# EAGLE design SkyKontrol-Display (EAGLE 9.5.1)
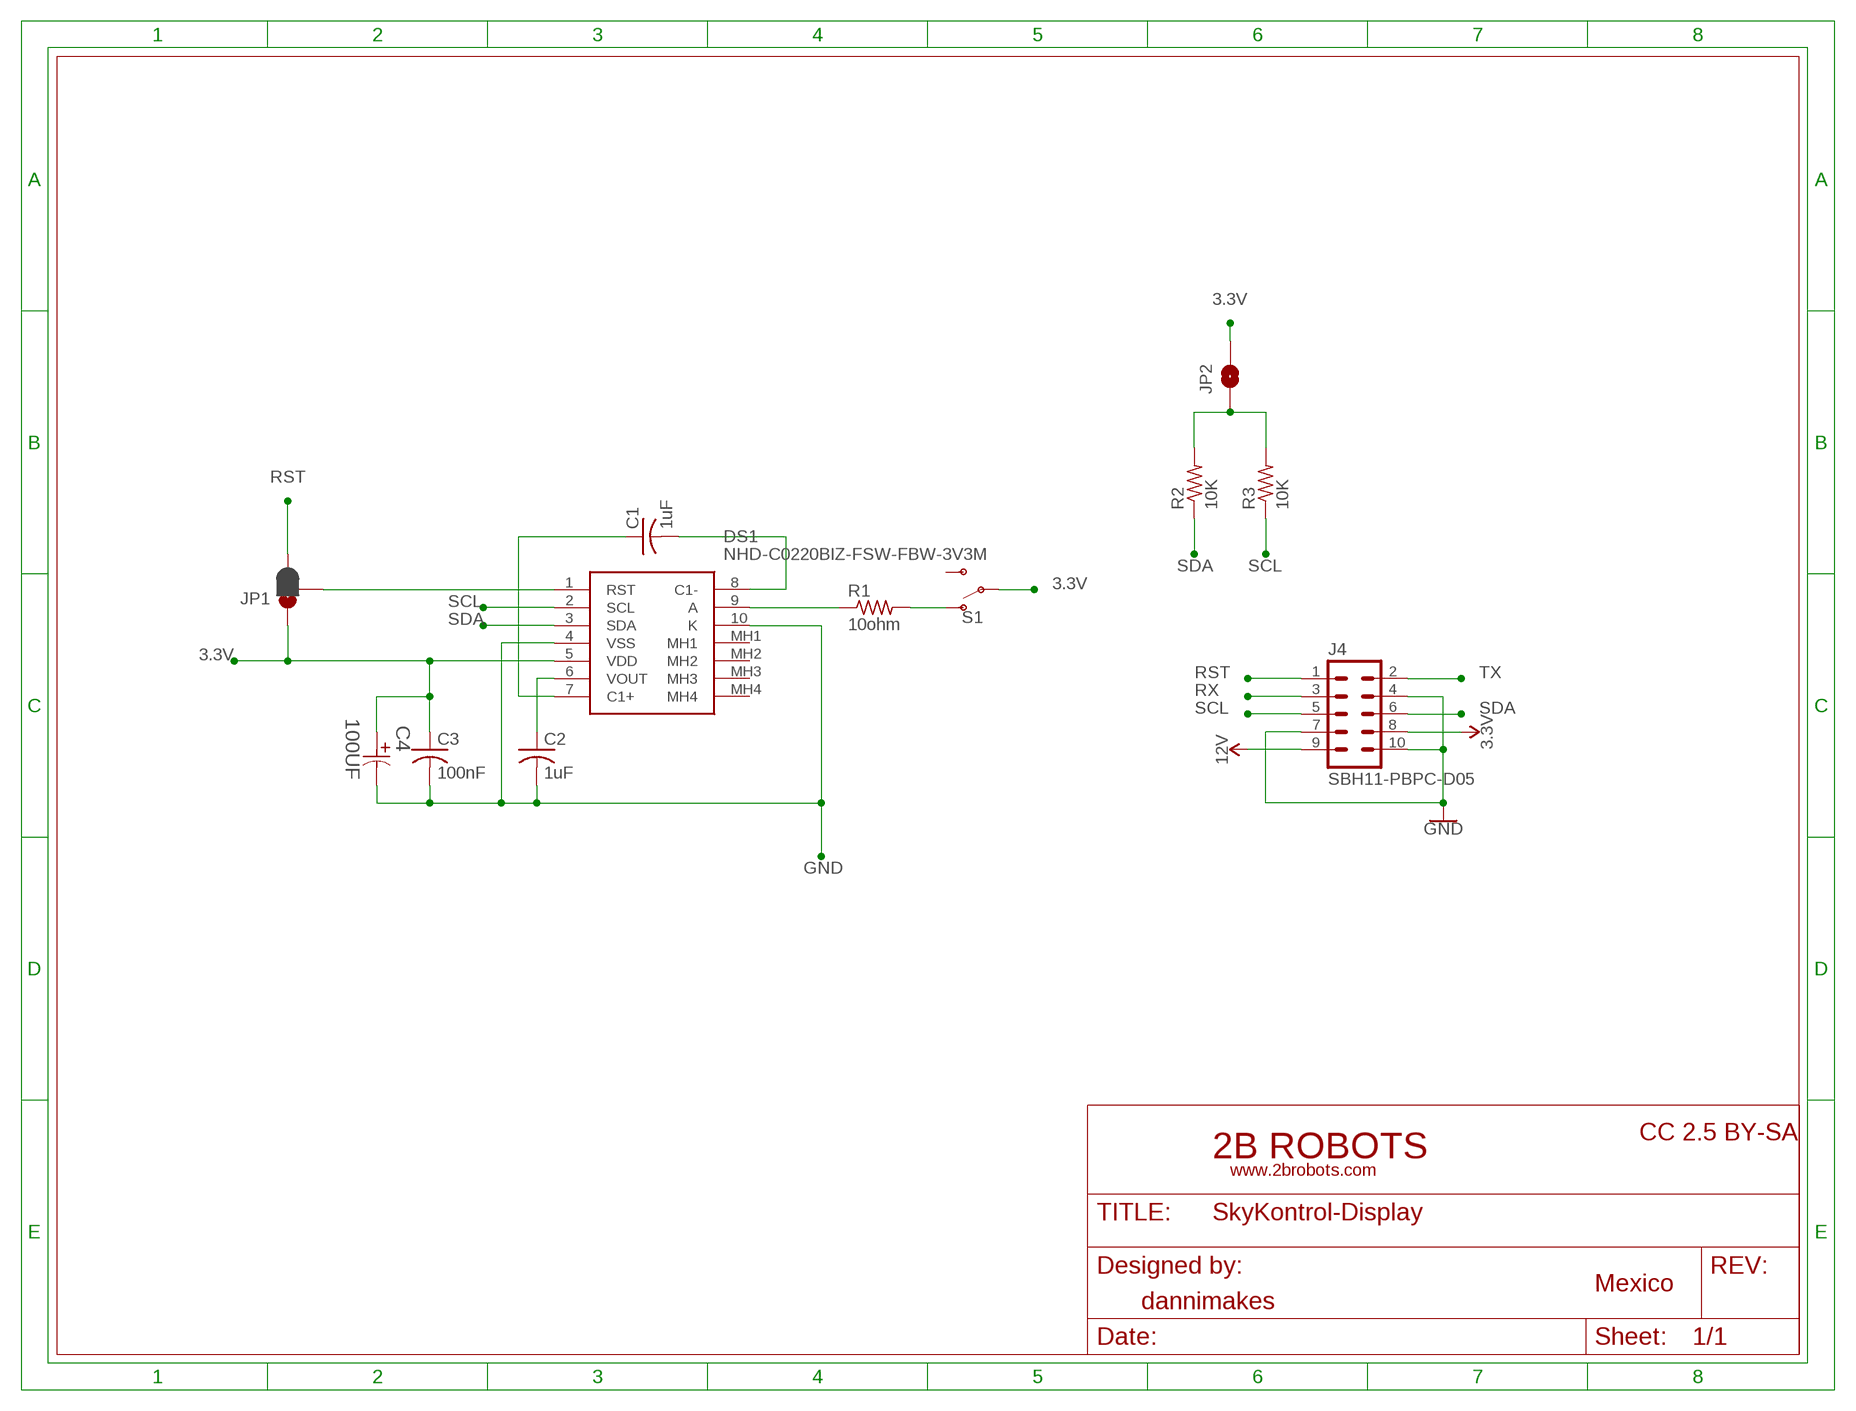
[diagram p0: schematic, sheet 1]

## Parts
C1  1uF  C-USC0603K  [C0603K]
C2  1uF  C-USC0603K  [C0603K]
C3  100nF  C-USC0603K  [C0603K]
C4  100UF  EEE-HA1E101XP-CASE-D8  [CAPAE660X800N]
DS1  NHD-C0220BIZ-FSW-FBW-3V3M  [NHDC0220BIZFSWFBW3V3M]
J4  SBH11-PBPC-D05  [SBH11-PBPC-D05]
JP1  JUMPER-SMT_3_1-NC_PASTE_SILK  [SMT-JUMPER_3_1-NC_PASTE_SILK]
JP2  JUMPER-SMT_2_NO_SILK  [SMT-JUMPER_2_NO_SILK]
R1  10ohm  R-US_R0805  [R0805]
R2  10K  R-US_R0805  [R0805]
R3  10K  R-US_R0805  [R0805]
S1  SWITCH-SPDT-SMD-RIGHT-ANGLE  [SWITCH_SPST_SMD_A]

## Nets
3.3V: C3.1 C4.1 DS1.5(VDD) J4.8 JP1.1 JP2.2 S1.2(P)
12V: J4.9
GND: C2.2 C3.2 C4.2 DS1.4(VSS) DS1.10(K) J4.4 J4.7 J4.10
N$1: C2.1 DS1.6(VOUT)
N$2: C1.2 DS1.8(C1-)
N$3: C1.1 DS1.7(C1+)
N$4: DS1.9(A) R1.1
N$8: JP2.1 R2.2 R3.2
N$9: R1.2 S1.1(O)
N$10: DS1.1(RST) JP1.2
RST: J4.1 JP1.3
RX: J4.3
SCL: DS1.2(SCL) J4.5 R3.1
SDA: DS1.3(SDA) J4.6 R2.1
TX: J4.2
Unconnected: DS1.MH1 DS1.MH2 DS1.MH3 DS1.MH4 S1.3(S)

## Library data of the parts
C1-C3 = adafruit:C-US: CAPACITOR, American symbol
C4 = Panasonic-EEEFT_EEEH:EEE-: Aluminum Electrolytic Capacitors,Surface Mount Type; MPN: EEE-HA1E101XP; OC_FARNELL: 1973328; OC_NEWARK: 58T9236; PACKAGE: CASE-D8; SUPPLIER: PANASONIC; TOLERANCE: ±20 %; VOLTAGERATING: 25V
DS1 = NHD-C0220BIZ-FSW-FBW-3V3M:NHD-C0220BIZ-FSW-FBW-3V3M: LCD Character Display Modules & Accessories 2 x 20 FSTN (+) Transf White LED Source: Datasheet <https://componentsearchengine.com/Datasheets/1/NHD-C0220BiZ-FSW-FBW-3V3M.pdf>; DESCRIPTION: LCD Character Display Modules & Accessories 2 x 20 FSTN (+) Transf White LED; HEIGHT: 7mm; MANUFACTURER_NAME: Newhaven Display; MANUFACTURER_PART_NUMBER: NHD-C0220BIZ-FSW-FBW-3V3M; MOUSER_PART_NUMBER: 763-C0220BIZ-FSW-FBW; MOUSER_PRICE-STOCK: https://www.mouser.com/Search/Refine.aspx?Keyword=763-C0220BIZ-FSW-FBW
J4 = con-sullins:SBH11-PBPC-D05: HEADER - Vertical, Shrouded
JP1 = SparkFun-Jumpers:JUMPER-SMT_3_1-NC_PASTE: Normally closed solder jumper (1 of 2 connections) This jumper has an aperture in the stencil to allow solder paste to bridge one of the two connections. One connection is normally closed (NC), while the other is normally open (NO). Wick off the solder to open the connection. Reapply solder to reclose the connection. Apply solder to the other side instead to change the current path.
JP2 = SparkFun-Jumpers:JUMPER-SMT_2_NO: Normally open jumper This jumper has two pads in close proximity to each other. Apply solder to close the connection. Round pads are easier to solder for beginners, but are a lot larger. SparkFun Product that uses the round pads: SparkFun EL Sequencer <https://www.sparkfun.com/products/12781>
R1-R3 = adafruit:R-US_: RESISTOR, American symbol
S1 = SparkFun-Switches:SWITCH-SPDT: Single Pole, Double Throw (SPDT) Switch Single-pole, double-throw (SPDT) switch. Variant Overview SMD-AYZ0202 Surface Mount DPDT Switch <https://www.sparkfun.com/products/597> (COM-00597) Used on e.g. LilyPad Arduino USB - ATmega32U4 Board <https://www.sparkfun.com/products/12049> PTH-11.6X4.0MM SPDT Mini Power Switch <https://www.sparkfun.com/products/102> (COM-00102) Used on e.g. SparkFun Simon Says - Through-Hole Soldering Kit <https://www.sparkfun.com/products/10547> (KIT-10547) PTH-11.6X4.0MM-KIT KIT version of SPDT Mini Power Switch - Simplifies soldering by removing tStop of switch pins - only one side can be soldered. PTH-11.6X4.0MM-LOCK LOCK version of SPDT Mini Power Switch - Offset pins hold switch in place for easier soldering. SMD-RIGHT-ANGLE Surface Mount Right Angle Switch <https://www.sparkfun.com/products/10860> (COM-10860) Used on e.g. SparkFun ESP8266 Thing <https://www.sparkfun.com/products/13231>; PROD_ID: SWCH-10651; SF_SKU: COM-10860

## Board
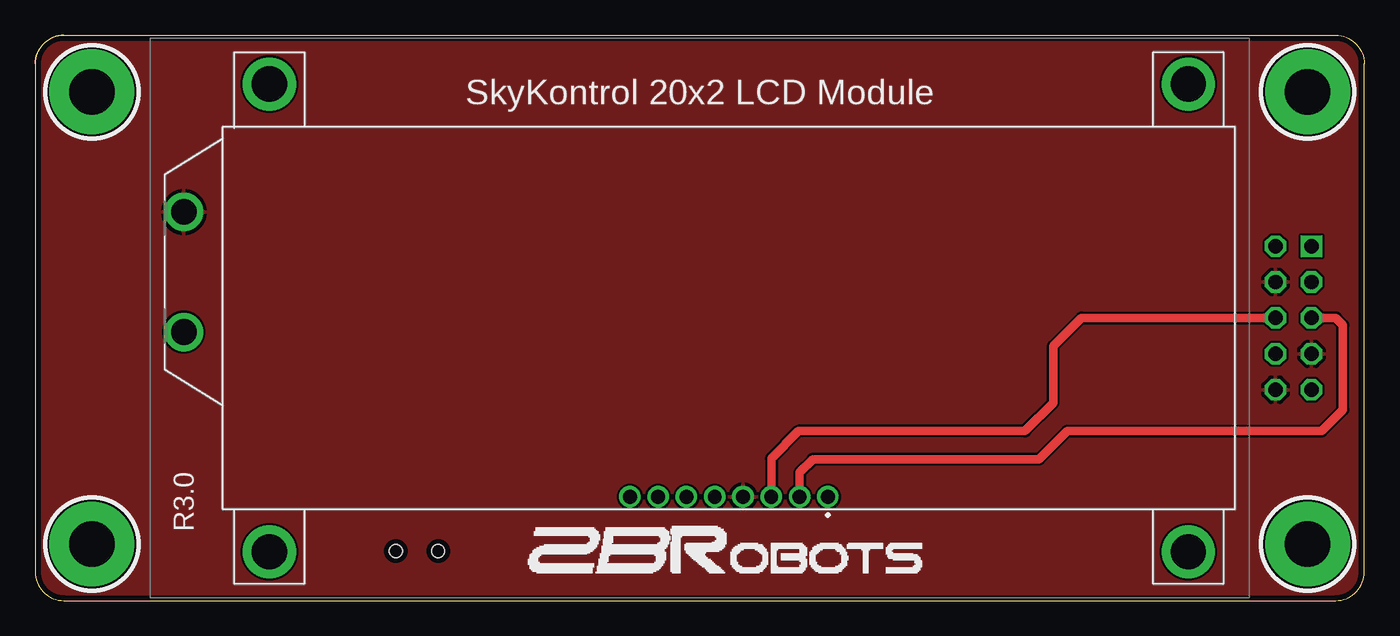
[diagram p1: board, top side]
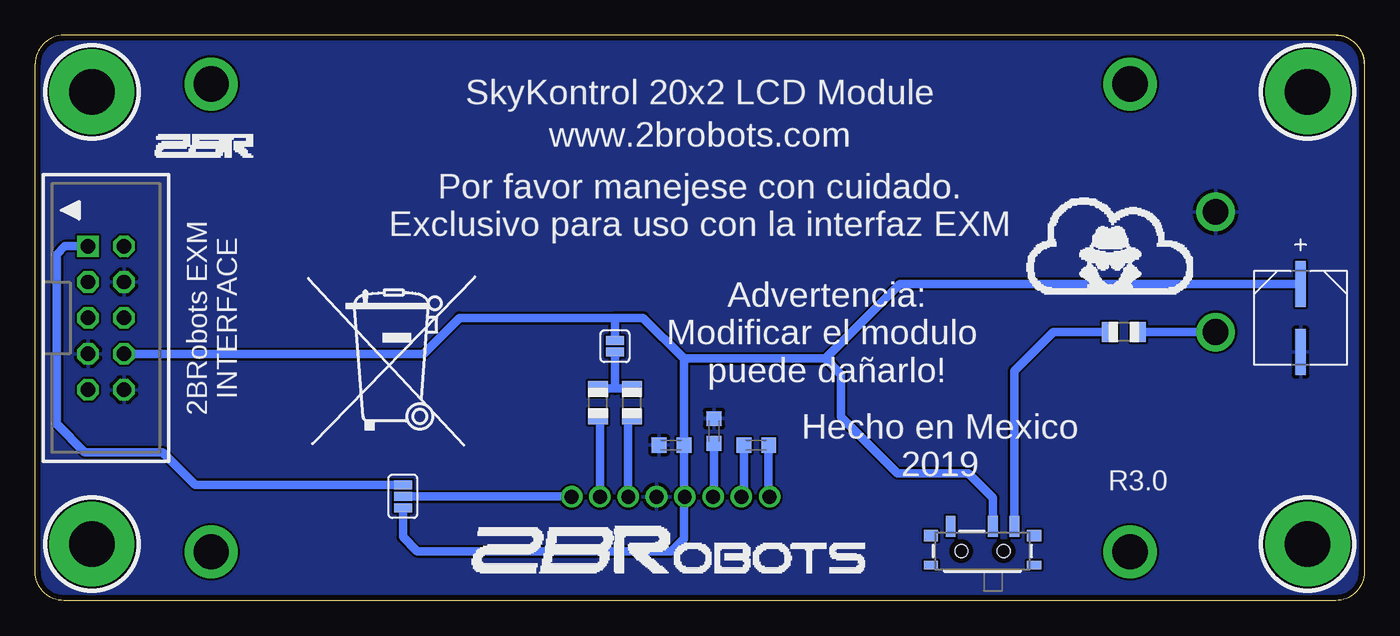
[diagram p2: board, bottom side, seen from below]

Size 94 x 40 mm. Coordinates in mm from the lower left corner, seen from the top.
Outline: 0,38 0,2 arc90 2,0 92,0 arc90 94,2 94,38 arc90 92,40 2,40
Outline: 2,40 arc90 0,38
Outline: 0,38 arc-90 2,40
Copper layers (1*16): Top 0.0356mm / dielectric 1.5011mm / Bottom 0.0356mm
Design rules "2brobots-2layer": minimum track width 6mil, minimum drill 0.3mm, track to track 6mil, track to pad 6mil, pad to pad 6mil, via to via 6mil, smd to smd 6mil, copper to edge 15mil, drill to drill 6mil, minimum pad ring 7mil, minimum via ring 7mil, stop-mask expansion 2.5mil, vias tented up to drill 50mil, thermal gap 10mil

### Footprints (pad centres in the part's own frame; a part is rotated, then mirrored left to right if it is on the bottom)
C0603K = smd 1.05 x 1.08: 1 -0.875,0; 2 0.875,0
CAPAE660X800N = smd 3.251 x 0.762: 1 -2.413,0; 2 2.413,0
NHDC0220BIZFSWFBW3V3M = drill 0.98 pad 1.524: 1 9.058,-12.65; 2 7.058,-12.65; 3 5.058,-12.65; 4 3.058,-12.65; 5 1.058,-12.65; 6 -0.942,-12.65; 7 -2.942,-12.65; 8 -4.942,-12.65 | drill 1.82 pad 2.73: 9 -36.492,-1; 10 -36.492,7.5 | drill 2.5 pad 3.75: MH1 -30.442,-16.55; MH2 34.558,-16.55; MH3 -30.442,16.55; MH4 34.558,16.55
SBH11-PBPC-D05 = drill 1.016 square: 1 -5.08,-1.27 | drill 1.016 octagon: 2 -5.08,1.27; 3 -2.54,-1.27; 4 -2.54,1.27; 5 0,-1.27; 6 0,1.27; 7 2.54,-1.27; 8 2.54,1.27; 9 5.08,-1.27; 10 5.08,1.27
SMT-JUMPER_3_1-NC_PASTE_SILK = smd 0.635 x 1.27: 1 -0.813,0; 2 0,0; 3 0.813,0
SMT-JUMPER_2_NO_SILK = smd 0.635 x 1.27: 1 -0.406,0; 2 0.406,0
R0805 = smd 1.1 x 1.4: 1 -1,0; 2 1,0
SWITCH_SPST_SMD_A = smd 0.7 x 1.5: 1 -2.25,-1.75; 2 -0.75,-1.75; 3 2.25,-1.75 | smd 1 x 0.6: GND1 -3.65,1; GND3 3.65,1 | smd 1 x 0.8: GND2 -3.65,-1.1; GND4 3.65,-1.1 | hole 0.9: -1.5,0; 1.5,0

### Placement (x,y rotation side)
C1  43,11 0 bottom
C2  46,12 90 bottom
C3  49,11 180 bottom
C4  4.5,20 270 bottom
DS1  47,20 0 top
J4  89,20 270 bottom
JP1  68,7.38 90 bottom
JP2  53,18 90 bottom
R1  17,19 180 bottom
R2  51.8,14 90 bottom
R3  54.2,14 90 bottom
S1  27,3.5 180 bottom
U$1  [MUELLTONNE]  75.5,10.5 0 bottom

### Tracks (layer width: path | path; a pad name or v marks a point on that pad's centre or on a via)
3.3V
  Bottom 0.61: 48.12,7.42 C3.1 48.12,17.12 | 48.12,7.42 DS1.5 | 48.12,17.12 51,20 53,20 | JP2.2 53,20 | 48.12,17.12 38.12,17.12 | S1.2 26.25,7.25 28,9 33,9 37,13 37,16 38.12,17.12 | J4.8 66.54,17.46 64,20 53,20 | JP1.1 68,4.5 67,3.5 49,3.5 48.12,4.38 48.12,7.42 | 38.12,17.12 32.84,22.41 C4.1
GND
  pour Top: 0,0 94,0 94,40 0,40
  pour Bottom: 0,0 94,0 94,40 0,40
N$1
  Bottom 0.61: C2.1 46,7.41 DS1.6
N$2
  Bottom 0.61: C1.2 42.12,7.42 DS1.8
N$3
  Bottom 0.61: C1.1 43.88,7.53 DS1.7
N$4
  Bottom 0.61: DS1.9 R1.1
N$5  (via drill 3.2 pad 6)
  other vias: 90,36
N$6  (via drill 3.2 pad 6)
  other vias: 4,36
N$7  (via drill 3.2 pad 6)
  other vias: 4,4
N$8
  Bottom 0.61: R2.2 53,15 | 53,15 R3.2 | 53,15 JP2.1
N$9
  Bottom 0.61: S1.1 24.75,16.25 22,19 R1.2
N$10
  Bottom 0.61: JP1.2 56.08,7.38 DS1.1
N$11  (via drill 3.2 pad 6)
  other vias: 90,4
RST
  Bottom 0.61: J4.1 91.92,25.08 92.5,24.5 92.5,12.5 90.5,10.5 85,10.5 82.69,8.19 JP1.3
SCL
  Top 0.61: J4.5 92,20 92.5,19.5 92.5,13.5 91,12 73,12 71,10 55,10 54.06,9.06 DS1.2
  Bottom 0.61: R3.1 54.06,12.94 DS1.2
SDA
  Top 0.61: J4.6 74,20 72,18 72,14 70,12 54,12 52.06,10.06 DS1.3
  Bottom 0.61: R2.1 52.06,12.94 DS1.3

### Text on the board
tPlace: SkyKontrol 20x2 LCD Module | R3.0
bPlace: SkyKontrol 20x2 LCD Module | www.2brobots.com | Por favor manejese con cuidado. / Exclusivo para uso con la interfaz EXM | 2BRobots EXM / INTERFACE | Advertencia: / Modificar el modulo / puede dañarlo! | Hecho en Mexico / 2019 | R3.0
tStop: 2brobots.com